# Altium project MB1520.PrjPcb (part 4 of 5)

## Sheet STlink_V3E_Module.SchDoc: STLINK-V3E SWD Module
size A4; Date: Not used; ApprovedBy: Not used; CheckedBy: Not used; Author: Not used; CompanyName: STMicroelectronics; DrawnBy: Not used; Engineer: Not used; Organization: Not used; Address1: Not used; Address2: Not used; Address3: Not used; Address4: Not used; DocumentNumber: Not used; Revision: Not used; SheetNumber: 17; SheetTotal: 19; CurrentTime: Not used; CurrentDate: Not used; Time: Not used; DocumentFullPathAndName: Not used; DocumentName: Not used; ModifiedDate: Not used; ImagePath: Not used; ProjectName: Not used; Application_BuildNumber: Not used
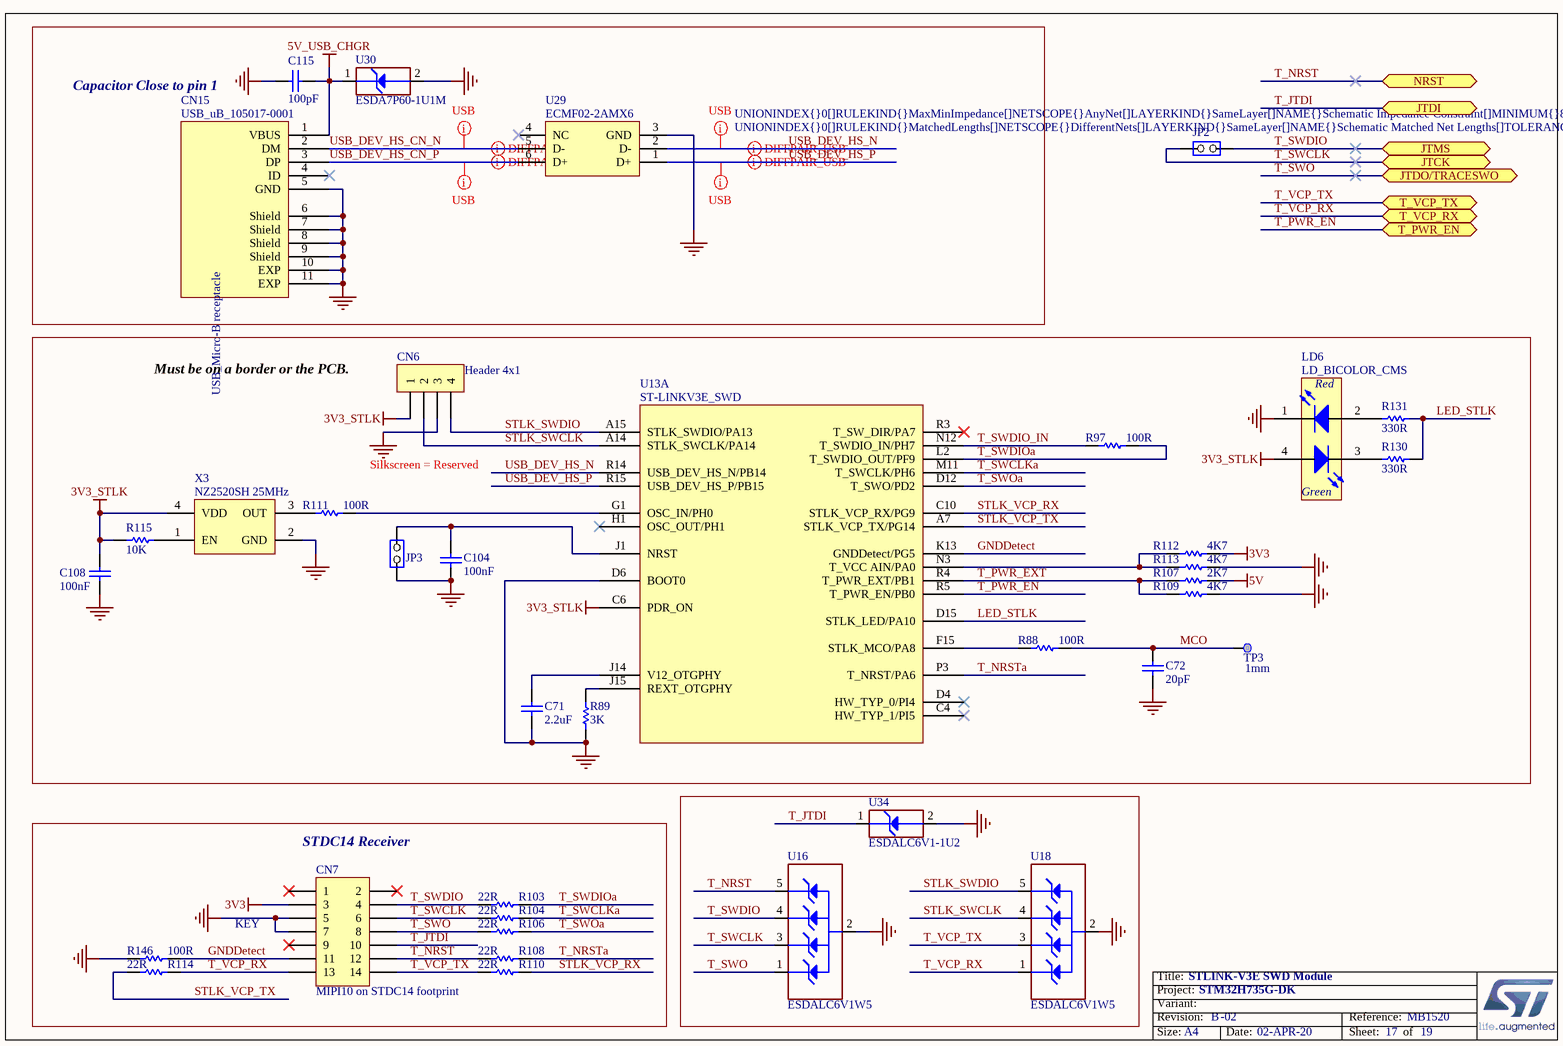
[diagram p12: STlink_V3E_Module.SchDoc]

### Parts
C71  value 2.2uF  [C0603]  (hidden comment: Capacitor)
C72  value 20pF  [C0402]  (hidden comment: Capacitor)
C104  value 100nF  [C0402]  (hidden comment: Capacitor)
C108  value 100nF  [C0402]  (hidden comment: Capacitor)
C115  value 100pF  [C0402]  (hidden comment: Capacitor)
CN6  Header 4x1  [CON_SAMTEC_TSW-104-07-G-S]
CN7  value MIPI10 on STDC14 footprint  [CON_STDC14_Receiver_MEDIUM_WITH_MIPI10_3D]  (hidden comment: Header 7x2)
CN15  value USB_uB_105017-0001  [CON_USBMICROB_MOLEX_105017-0001_H2P90]  (hidden comment: USB_uB_105017.0001)
JP2  Jumper_Header 2x1  [CON_SAMTEC_TSW-102-07-G-S]  (value not drawn)
JP3  Jumper_Header 2x1  [CON_SAMTEC_TSW-102-07-G-S]  (value not drawn)
LD6  LD_BICOLOR_CMS  [LED_BI-GR_HSMF-A201-A00J1]
R88  value 100R  [R0402]  (hidden comment: Resistor)
R89  value 3K  [R0402]  (hidden comment: Resistor)
R97  value 100R  [R0402]  (hidden comment: Resistor)
R103  value 22R  [R0402]  (hidden comment: Resistor)
R104  value 22R  [R0402]  (hidden comment: Resistor)
R106  value 22R  [R0402]  (hidden comment: Resistor)
R107  value 2K7  [R0402]  (hidden comment: Resistor)
R108  value 22R  [R0402]  (hidden comment: Resistor)
R109  value 4K7  [R0402]  (hidden comment: Resistor)
R110  value 22R  [R0402]  (hidden comment: Resistor)
R111  value 100R  [R0402]  (hidden comment: Resistor)
R112  value 4K7  [R0402]  (hidden comment: Resistor)
R113  value 4K7  [R0402]  (hidden comment: Resistor)
R114  value 22R  [R0402]  (hidden comment: Resistor)
R115  value 10K  [R0402]  (hidden comment: Resistor)
R130  value 330R  [R0603]  (hidden comment: Resistor)
R131  value 330R  [R0603]  (hidden comment: Resistor)
R146  value 100R  [R0402]  (hidden comment: Resistor)
TP3  value 1mm  [TP_SMD_1MM]  (hidden comment: Test Point)  (no BOM)
U13  ST-LINKV3E_SWD  [ICC_UFBGA201_176+25_10X10_P065]  (part A of 2)
U16  ESDALC6V1W5  [ESD_SOT323-5L]
U18  ESDALC6V1W5  [ESD_SOT323-5L]
U29  ECMF02-2AMX6  [ESD_QFN-6L_1P7X1P5_P050]
U30  value ESDA7P60-1U1M  [ESD_QFN2_1P6X1_P125]  (hidden comment: ESD-TRANSIL)
U34  value ESDALC6V1-1U2  [ESD_ST0201]  (hidden comment: ESD-TRANSIL)
X3  value NZ2520SH 25MHz  [OSC_NDK_NZ2520SB_4P]  (hidden comment: OSCILLATOR_4_PINS)

### Blocks framed on the sheet
Capacitor Close to pin 1: C115 CN15 U29 U30
Must be on a border or the PCB.: C71 C72 C104 C108 CN6 JP3 LD6 R88 R89 R97 R107 R109 R111-R113 R115 R130 R131 TP3 U13 X3
STDC14 Receiver: CN7 R103 R104 R106 R108 R110 R114 R146

### Ports
JTCK, JTDI, JTDO/TRACESWO, JTMS, NRST, T_PWR_EN, T_VCP_RX, T_VCP_TX

### Nets
3V3: CN7.3 R112.2
3V3_STLK: C108.2 CN6.1 LD6.4(YellowGreen_anode) R115.1 U13.C6(PDR_ON) X3.4(VDD)
5V: R107.1
5V_USB_CHGR: C115.2 CN15.1(VBUS) U30.1(IO1)
GND: C71.1 C72.1 C104.1 C108.1 C115.1 CN6.3 CN7.5 CN7.7 CN15.5(GND) CN15.6(Shield) CN15.7(Shield) CN15.8(Shield) CN15.9(Shield) CN15.10(EXP) CN15.11(EXP) JP3.1(COMMON) LD6.1(RED_cathode) R89.1 R109.1 R113.2 R146.1 U13.D6(BOOT0) U16.2(GND) U18.2(GND) U29.3(GND) U30.2(GND) U34.2(GND) X3.2(GND)  [project net POE7]
GNDDetect: CN7.11 R146.2 U13.K13(GNDDetect/PG5)
LED_STLK: R130.2 R131.2 U13.D15(STLK_LED/PA10)
MCO: C72.2 R88.2 TP3.1
STLK_SWCLK: CN6.2 U13.A14(STLK_SWCLK/PA14) U18.4(IO3)
STLK_SWDIO: CN6.4 U13.A15(STLK_SWDIO/PA13) U18.5(IO4)
STLK_VCP_RX: R110.2 U13.C10(STLK_VCP_RX/PG9)
STLK_VCP_TX: R114.1 U13.A7(STLK_VCP_TX/PG14)
T_JTDI: CN7.10 U34.1(IO1) ; port JTDI
T_NRST: CN7.12 R108.1 U16.5(IO4) ; port NRST  [project net RESET]
T_NRSTa: R108.2 U13.P3(T_NRST/PA6)
T_PWR_EN: U13.R5(T_PWR_EN/PB0) ; port T_PWR_EN
T_PWR_EXT: R107.2 R109.2 U13.R4(T_PWR_EXT/PB1)
T_SWCLK: CN7.6 JP2.1(COMMON) R104.1 U16.3(IO2) ; port JTCK
T_SWCLKa: R104.2 U13.M11(T_SWCLK/PH6)
T_SWDIO: CN7.4 JP2.2(NO) R103.1 U16.4(IO3) ; port JTMS
T_SWDIO_IN: R97.1 U13.N12(T_SWDIO_IN/PH7)
T_SWDIOa: R97.2 R103.2 U13.L2(T_SWDIO_OUT/PF9)
T_SWO: CN7.8 R106.1 U16.1(IO1) ; port JTDO/TRACESWO
T_SWOa: R106.2 U13.D12(T_SWO/PD2)
T_VCP_RX: CN7.13 R114.2 U18.1(IO1) ; port T_VCP_RX
T_VCP_TX: CN7.14 R110.1 U18.3(IO2) ; port T_VCP_TX
USB_DEV_HS_CN_N: CN15.2(DM) U29.5(D-)
USB_DEV_HS_CN_P: CN15.3(DP) U29.6(D+)
USB_DEV_HS_N: U13.R14(USB_DEV_HS_N/PB14) U29.2(D-)
USB_DEV_HS_P: U13.R15(USB_DEV_HS_P/PB15) U29.1(D+)
NetC71_2: C71.2 U13.J14(V12_OTGPHY)
NetC104_2: C104.2 JP3.2(NO) U13.J1(NRST)
NetLD6_2: LD6.2(Red_anode) R131.1
NetLD6_3: LD6.3(YellowGreen_cathode) R130.1
NetR88_1: R88.1 U13.F15(STLK_MCO/PA8)
NetR89_2: R89.2 U13.J15(REXT_OTGPHY)
NetR111_1: R111.1 X3.3(OUT)
NetR111_2: R111.2 U13.G1(OSC_IN/PH0)
NetR112_1: R112.1 R113.1 U13.N3(T_VCC_AIN/PA0)
NetR115_2: R115.2 X3.1(EN)

Not connected (* = marked no-connect by the designer): CN7 1* 2* 9*; CN15 4(ID)*; U13 C4(HW_TYP_1/PI5)* D4(HW_TYP_0/PI4)* H1(OSC_OUT/PH1)* R3(T_SW_DIR/PA7)*; U29 4(NC)*

### Layout directives
differential pair; rule Impedance Constraint [Min = 85.00    Max = 95.00    ]: USB_DEV_HS_CN_N, USB_DEV_HS_CN_P, USB_DEV_HS_N, USB_DEV_HS_P
rule Undefined; rule Matched Net Lengths [Tolerance = 0.2mm]; rule Impedance Constraint [Min = 85.00    Max = 95.00    ]: USB_DEV_HS_CN_N, USB_DEV_HS_CN_P, USB_DEV_HS_N, USB_DEV_HS_P

### Notes on the sheet
- Silkscreen = Reserved
- KEY
- Title:
- Project:
- Size:
- Revision:
- Variant:
- A4
- -
- Date:
- Reference:
- Sheet:
- of
- (in symbol MCD-00028) USB_Micro-B receptacle
- (in symbol MCD-00051) Red; Green

### Library data of the parts
C71 = MCD-00012: Capacitor, MLCC, 2.2uF, 10V, X5R, 10%, 0603, T=0,8mm; Manufacturer_Part_Number: CC0603KRX5R6BB225; Manufacturer: YAGEO; Alternate_Manufacturer_Part_Number: C0603C225K8PACTU; Alternate_Manufacturer: KEMET; Provided_By: SUBCO; Internal_Part_Number: MCD-00012; Status: Released; Package: C0603; ComponentLink1Description: Datasheet; Part_Type: Capacitor; ComponentLink1URL: http://tunmcdsvn.tun.st.com/Component_Datasheet_Library/Trunk/Capacitors/Yageo_Multilayer_capacitor_X5R_series_100pF_to_100uF
C72 = MCD-00016: Capacitor, MLCC, 20pF, 50V, NPO, 5%, 0402, T=0,5mm; Manufacturer_Part_Number: CC0402JRNPO9BN200; Manufacturer: YAGEO; Provided_By: SUBCO; Internal_Part_Number: MCD-00016; Status: Released; Package: C0402; ComponentLink1Description: Datasheet; Part_Type: Capacitor; ComponentLink1URL: http://tunmcdsvn.tun.st.com/Component_Datasheet_Library/Trunk/Capacitors/Yageo_Capacitor_NP0_16V-to-50V
C104 C108 = MCD-00102: Capacitor, MLCC, 100nF, 16V, X7R, 10%, 0402, T=0,5mm; Manufacturer_Part_Number: CC0402KRX7R7BB104; Manufacturer: YAGEO; Alternate_Manufacturer_Part_Number: GCM155R71C104KA55D; Alternate_Manufacturer: MURATA; Provided_By: SUBCO; Internal_Part_Number: MCD-00102; Status: Released; Package: C0402; ComponentLink1Description: Datasheet; Part_Type: Capacitor; ComponentLink1URL: http://tunmcdsvn.tun.st.com/Component_Datasheet_Library/Trunk/Capacitors/Yageo_Multilayer_Capacitor_X7R_series_100pF_to_22uF
C115 = MCD-00205: Capacitor, MLCC, 100pF, 50V, NPO, 5%, 0402, T=0,5mm; Manufacturer_Part_Number: CC0402JRNPO9BN101; Manufacturer: YAGEO; Provided_By: SUBCO; Internal_Part_Number: MCD-00205; Status: Released; Part_Type: Capacitor; Package: C0402; ComponentLink1Description: Datasheet; ComponentLink1URL: http://tunmcdsvn.tun.st.com/Component_Datasheet_Library/Trunk/Capacitors/Yageo_Capacitor_NP0_16V-to-50V
CN6 = MCD-00029: Header, 4x1, 2,54mm, VR, TH, Height 5.84mm/2.54mm; Manufacturer_Part_Number: TSW-104-07-x-S; Manufacturer: SAMTEC; Part_Type: Connector; Provided_By: SUBCO; Internal_Part_Number: MCD-00029; Value: Header 4x1; Status: Released; ComponentLink1Description: Datasheet; ComponentLink1URL: http://tunmcdsvn.tun.st.com/Component_Datasheet_Library/Trunk/Connectors/Samtec_TSW-HTSW-series
CN7 = MCD-01226: Header 5x2, 1.27mm, Dual row, Straight, Surface mount, vertical male connector. 3.05mm lead. Mates with FFSD connector. Footprint compatible with FTSH-107-01-L-DV,-K,-A,-P,-ES (STDC14 MEDIUM); Manufacturer_Part_Number: FTSH-105-01-L-DV-K; Manufacturer: SAMTEC; Alternate_Manufacturer_Part_Number: P127B-2x05MGF-079-1A; Alternate_Manufacturer: JIUBABA; Provided_By: SUBCO; Internal_Part_Number: MCD-01226; Status: Released; Part_Type: Connector; ComponentLink1Description: Datasheet; ComponentLink1URL: http://tunmcdsvn.tun.st.com/Component_Datasheet_Library/Trunk/Connectors/Samtec_FTSH_smt_series; ECCN_US: n/a; ECCN_EU: n/a
CN15 = MCD-00028: USB-MICRO-B, 0.65mm, RA, SMT, Bottom Mount,; Manufacturer_Part_Number: 1050170001; Manufacturer: MOLEX; Part_Type: Connector; Provided_By: SUBCO; Internal_Part_Number: MCD-00028; Status: Released; ComponentLink1Description: Datasheet; ComponentLink1URL: http://tunmcdsvn.tun.st.com/Component_Datasheet_Library/Trunk/Connectors/Molex_Connector-USB-microB_105017-0001
JP2 JP3 = MCD-00045: Header, 2x1, 2,54mm, VR, TH, Height 5.84mm/2.54mm; Manufacturer_Part_Number: TSW-102-07-x-S; Manufacturer: SAMTEC; Part_Type: Connector; Alternate_Manufacturer_Part_Number: 313102S111116; Alternate_Manufacturer: JIUBABA; Value: Shunt not fitted; Provided_By: SUBCO; Internal_Part_Number: MCD-00045; Status: Released; ComponentLink1Description: Datasheet; ComponentLink1URL: http://tunmcdsvn.tun.st.com/Component_Datasheet_Library/Trunk/Connectors/Samtec_TSW-HTSW-series
LD6 = MCD-00051: LED Bicolor; Part_Type: Display; Manufacturer_Part_Number: HSMF-A201-A00J1; Manufacturer: AVAGO TECHNOLOGIES; Alternate_Manufacturer_Part_Number: LE-RGW35280; Alternate_Manufacturer: EVERLUCK; Provided_By: SUBCO; Internal_Part_Number: MCD-00051; Value: LD_BICOLOR_CMS; Status: Released; ComponentLink1Description: Datasheet; ComponentLink1URL: http://tunmcdsvn.tun.st.com/Component_Datasheet_Library/Trunk/Display/Avago_LED-SMC_HSMx-A2xx-02Feb2012
R88 R97 R111 R146 = MCD-00119: Resistor,100R,0402,1%,1/16W; Manufacturer_Part_Number: RC0402FR-07100RL; Manufacturer: YAGEO; Provided_By: SUBCO; Internal_Part_Number: MCD-00119; Status: Released; Part_Type: Resistor; ComponentLink1Description: Datasheet; Package: R0402; ComponentLink1URL: http://tunmcdsvn.tun.st.com/Component_Datasheet_Library/Trunk/Resistors/Yageo_Resistor_RC0402-series
R89 = MCD-00185: Resistor,3K,0402,1%,1/16W; Manufacturer_Part_Number: RC0402FR-073KL; Manufacturer: YAGEO; Provided_By: SUBCO; Internal_Part_Number: MCD-00185; Status: Released; ComponentLink1Description: Datasheet; Part_Type: Resistor; Package: R0402; ComponentLink1URL: http://tunmcdsvn.tun.st.com/Component_Datasheet_Library/Trunk/Resistors/Yageo_Resistor_RC0402-series
R103 R104 R106 R108 R110 R114 = MCD-00189: Resistor,22R,0402,1%,1/16W; Manufacturer_Part_Number: RC0402FR-0722RL; Manufacturer: YAGEO; Provided_By: SUBCO; Internal_Part_Number: MCD-00189; Status: Released; Part_Type: Resistor; ComponentLink1Description: Datasheet; Package: R0402; ComponentLink1URL: http://tunmcdsvn.tun.st.com/Component_Datasheet_Library/Trunk/Resistors/Yageo_Resistor_RC0402-series
R107 = MCD-00055: Resistor,2K7,0402,1%,1/16W; Manufacturer_Part_Number: RC0402FR-072K7L; Manufacturer: YAGEO; Provided_By: SUBCO; Internal_Part_Number: MCD-00055; Status: Released; ComponentLink1Description: Datasheet; Part_Type: Resistor; Package: R0402; ComponentLink1URL: http://tunmcdsvn.tun.st.com/Component_Datasheet_Library/Trunk/Resistors/Yageo_Resistor_RC0402-series
R109 R112 R113 = MCD-00065: Resistor,4K7,0402,1%,1/16W; Manufacturer_Part_Number: RC0402FR-074K7L; Manufacturer: YAGEO; Alternate_Manufacturer_Part_Number: RT0402FRE074K7L; Provided_By: SUBCO; Internal_Part_Number: MCD-00065; Status: Released; ComponentLink1Description: Datasheet; Alternate_Manufacturer: YAGEO; Part_Type: Resistor; Package: R0402; ComponentLink1URL: http://tunmcdsvn.tun.st.com/Component_Datasheet_Library/Trunk/Resistors/Yageo_Resistor_RC0402-series
R115 = MCD-00053: Resistor,10K,0402,1%,1/16W; Manufacturer_Part_Number: RC0402FR-0710KL; Manufacturer: YAGEO; Provided_By: SUBCO; Internal_Part_Number: MCD-00053; Status: Released; ComponentLink1Description: Datasheet; Part_Type: Resistor; Package: R0402; ComponentLink1URL: http://tunmcdsvn.tun.st.com/Component_Datasheet_Library/Trunk/Resistors/Yageo_Resistor_RC0402-series
R130 R131 = MCD-00197: Resistor,330R,0603,1%,1/10W; Manufacturer_Part_Number: RC0603FR-07330RL; Manufacturer: YAGEO; BMS_Part_Number: 9129729; Provided_By: SUBCO; Internal_Part_Number: MCD-00197; Status: Released; ComponentLink1Description: Datasheet; Part_Type: Resistor; Package: R0603; ComponentLink1URL: http://tunmcdsvn.tun.st.com/Component_Datasheet_Library/Trunk/Resistors/Yageo_Resistor_RC0603-series
TP3 = MCD-00074: Test Point 1mm; Part_Type: Mechanical; Initial_Board_Reference: MB1274; Internal_Part_Number: MCD-00074; Status: Released; ECCN_US: n/a; ECCN_EU: n/a; Provided_By: n/a; Manufacturer_Part_Number: n/a; Manufacturer: n/a; ComponentLink1Description: Datasheet; ComponentLink1URL: http://na
U13 = MCD-00596: STM32F723IEK  (STM32F7) BGA176; Part_Type: IC; Manufacturer_Part_Number: STM32F723IEK6; Manufacturer: STMICROELECTRONICS; BMS_Part_Number: 9175300; Provided_By: SUBCO with ST control; Internal_Part_Number: MCD-00596; Value: ST-LINKV3E_SWD; Status: Released; ComponentLink1Description: Datasheet; ComponentLink1URL: http://tunmcdsvn.tun.st.com/Component_Datasheet_Library/Trunk/IC/BGA176+25L_10x10x0.6_pitch0.65
U16 U18 = MCD-00136: Dual Transil array for ESD protection; Part_Type: Diode; Manufacturer: STMICROELECTRONICS; BMS_Part_Number: 9151112; Provided_By: SUBCO with ST control; Internal_Part_Number: MCD-00136; Value: ESDALC6V1W5; Status: Released; Manufacturer_Part_Number: ESDALC6V1W5; ComponentLink1Description: Datasheet; ComponentLink1URL: http://tunmcdsvn.tun.st.com/Component_Datasheet_Library/Trunk/Diodes/STM_ESD_ESDALC6V1W5
U29 = MCD-00649: Common mode filter with ESD protection for USB 2.0 interface; Part_Type: Diode; Manufacturer: STMICROELECTRONICS; BMS_Part_Number: 9151138; Provided_By: SUBCO with ST control; Internal_Part_Number: MCD-00649; Value: ECMF02-2AMX6; Status: Released; Manufacturer_Part_Number: ECMF02-2AMX6; ComponentLink1Description: Datasheet; ComponentLink1URL: http://tunmcdsvn.tun.st.com/Component_Datasheet_Library/Trunk/Diodes/STM_ESD_ECMF02-2AMX6
U30 = MCD-00251: High power transient voltage suppressor, 7V breakdown; Part_Type: Diode; Manufacturer: STMICROELECTRONICS; BMS_Part_Number: 9179042; Provided_By: SUBCO with ST control; Internal_Part_Number: MCD-00251; Status: Released; Manufacturer_Part_Number: ESDA7P60-1U1M; ComponentLink1Description: Datasheet; ComponentLink1URL: http://tunmcdsvn.tun.st.com/Component_Datasheet_Library/Trunk/Diodes/STM_ESD_ESDA7P60-1U1M
U34 = MCD-00170: ESD protection 6V1; Part_Type: Diode; Manufacturer: STMICROELECTRONICS; BMS_Part_Number: 9151132; ECCN_US: EAR99; ECCN_EU: NEC; Provided_By: SUBCO with ST control; Internal_Part_Number: MCD-00170; Status: Released; Manufacturer_Part_Number: ESDALC6V1-1U2; ComponentLink1Description: Datasheet; ComponentLink1URL: http://tunmcdsvn.tun.st.com/Component_Datasheet_Library/Trunk/Diodes/STM_ESD_ESDALC6V1-1U2
X3 = MCD-00597: Oscillator 25Mhz, +-50ppm, Vcc:3.3V typ, square wave: [0.1Vcc;0.9Vcc], Enable pin, SMD; Part_Type: Crystal_Osc; Manufacturer_Part_Number: NZ2520SH 25MHz END4869C; Manufacturer: NDK; Alternate_Manufacturer_Part_Number: NZ2520SB 25MHz END4869B; BMS_Part_Number: 9157050; Provided_By: SUBCO; Internal_Part_Number: MCD-00597; Status: Released; Alternate_Manufacturer: NDK; ComponentLink1Description: Datasheet; ComponentLink1URL: http://tunmcdsvn.tun.st.com/Component_Datasheet_Library/Trunk/Crystal_Osc/NDK_NZ2520SH 25MHz END4869C

## Sheet STlink_V3E_PWR.SchDoc: STLINK-V3E SWD Power Module
size A4; Date: Not used; ApprovedBy: Not used; CheckedBy: Not used; Author: Not used; CompanyName: STMicroelectronics; DrawnBy: Not used; Engineer: Not used; Organization: Not used; Address1: Not used; Address2: Not used; Address3: Not used; Address4: Not used; DocumentNumber: Not used; Revision: Not used; SheetNumber: 18; SheetTotal: 19; CurrentTime: Not used; CurrentDate: Not used; Time: Not used; DocumentFullPathAndName: Not used; DocumentName: Not used; ModifiedDate: Not used; ImagePath: Not used; ProjectName: Not used; Application_BuildNumber: Not used
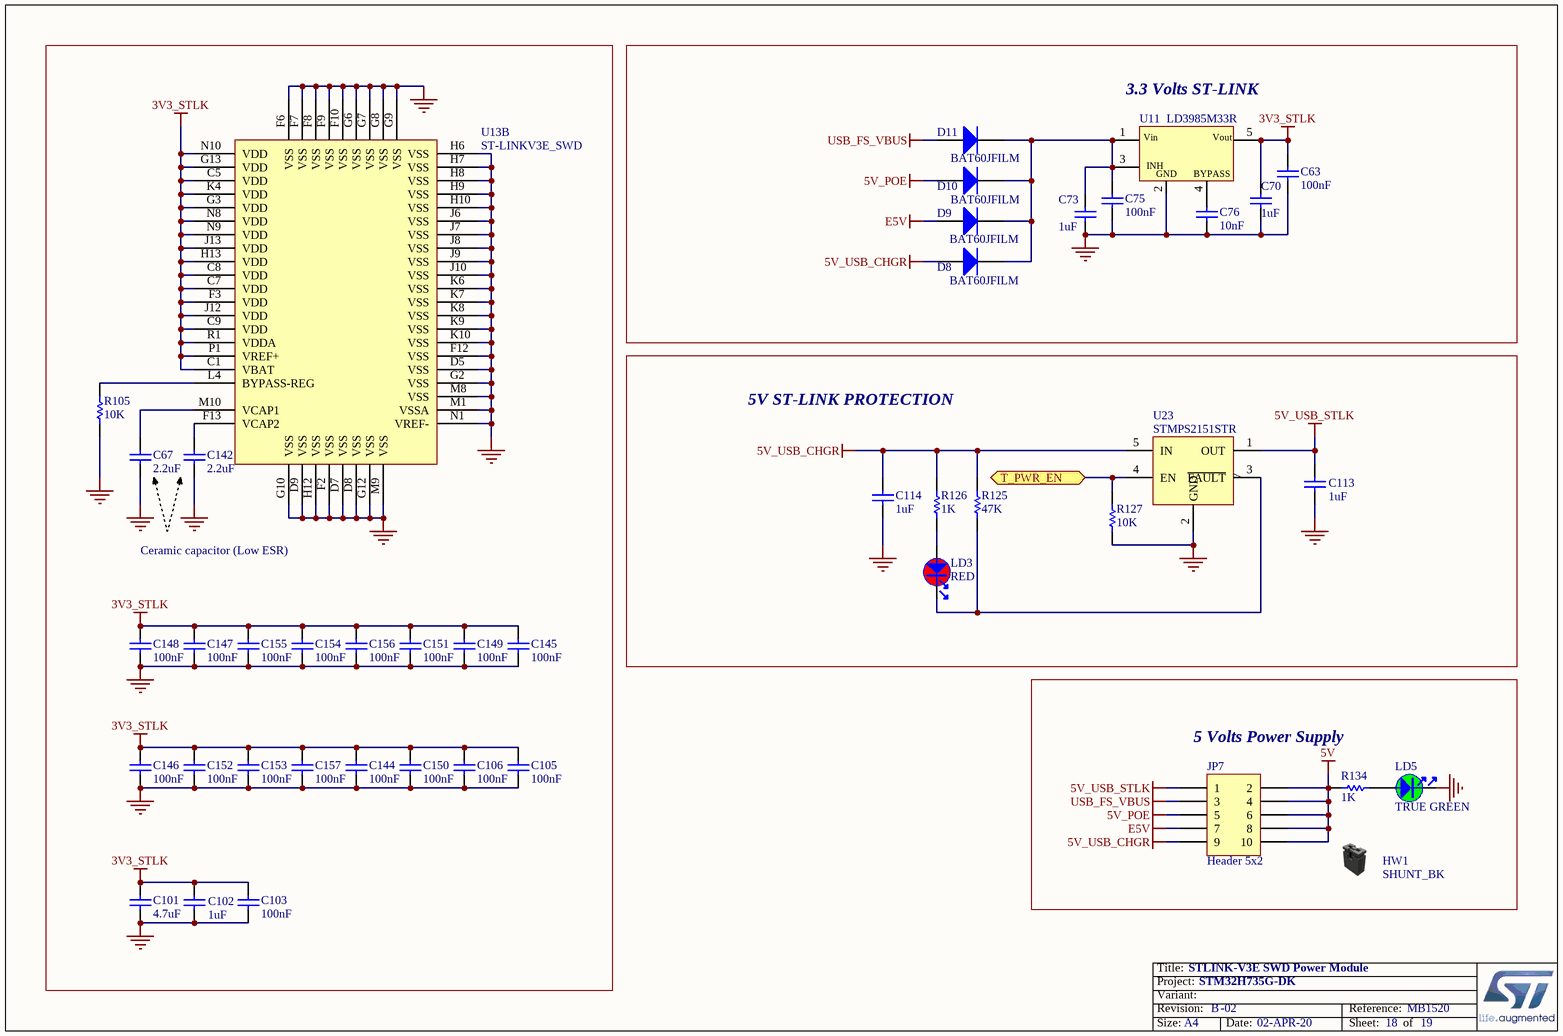
[diagram p13: STlink_V3E_PWR.SchDoc]

### Parts
C63  value 100nF  [C0402]  (hidden comment: Capacitor)
C67  value 2.2uF  [C1206_H1P15]  (hidden comment: Capacitor)
C70  value 1uF  [C0603]  (hidden comment: Capacitor)
C73  value 1uF  [C0603]  (hidden comment: Capacitor)
C75  value 100nF  [C0402]  (hidden comment: Capacitor)
C76  value 10nF  [C0402]  (hidden comment: Capacitor)
C101  value 4.7uF  [C0603]  (hidden comment: Capacitor)
C102  value 1uF  [C0603]  (hidden comment: Capacitor)
C103  value 100nF  [C0402]  (hidden comment: Capacitor)
C105  value 100nF  [C0402]  (hidden comment: Capacitor)
C106  value 100nF  [C0402]  (hidden comment: Capacitor)
C113  value 1uF  [C0603]  (hidden comment: Capacitor)
C114  value 1uF  [C0603]  (hidden comment: Capacitor)
C142  value 2.2uF  [C1206_H1P15]  (hidden comment: Capacitor)
C144  value 100nF  [C0402]  (hidden comment: Capacitor)
C145  value 100nF  [C0402]  (hidden comment: Capacitor)
C146  value 100nF  [C0402]  (hidden comment: Capacitor)
C147  value 100nF  [C0402]  (hidden comment: Capacitor)
C148  value 100nF  [C0402]  (hidden comment: Capacitor)
C149  value 100nF  [C0402]  (hidden comment: Capacitor)
C150  value 100nF  [C0402]  (hidden comment: Capacitor)
C151  value 100nF  [C0402]  (hidden comment: Capacitor)
C152  value 100nF  [C0402]  (hidden comment: Capacitor)
C153  value 100nF  [C0402]  (hidden comment: Capacitor)
C154  value 100nF  [C0402]  (hidden comment: Capacitor)
C155  value 100nF  [C0402]  (hidden comment: Capacitor)
C156  value 100nF  [C0402]  (hidden comment: Capacitor)
C157  value 100nF  [C0402]  (hidden comment: Capacitor)
D8  BAT60JFILM  [DIO_SOD323]
D9  BAT60JFILM  [DIO_SOD323]
D10  BAT60JFILM  [DIO_SOD323]
D11  BAT60JFILM  [DIO_SOD323]
HW1  value SHUNT_BK  [NA]  (hidden comment: Shunt Black 2.54mm)  (mechanical)
JP7  Header 5x2  [CON_988-JIUBABA_PHFS25-12-10-G0B115-T-1]
LD3  value RED  [LED_0603_VISHAY_VLMS1300-GS08_RED_1A2K_H0P8]  (hidden comment: LED_red)
LD5  value TRUE GREEN  [LED_0603_VISHAY_VLMTG1300-GS08_GREEN_1A2K_H0P8]  (hidden comment: LED_green)
R105  value 10K  [R0402]  (hidden comment: Resistor)
R125  value 47K  [R0402]  (hidden comment: Resistor)
R126  value 1K  [R0402]  (hidden comment: Resistor)
R127  value 10K  [R0402]  (hidden comment: Resistor)
R134  value 1K  [R0603]  (hidden comment: Resistor)
U11  LD3985M33R  [REG_SOT23-5L]
U13  ST-LINKV3E_SWD  [ICC_UFBGA201_176+25_10X10_P065]  (part B of 2)
U23  STMPS2151STR  [MOS_SOT23-5L]

### Blocks framed on the sheet
Ceramic capacitor (Low ESR): C67 C101-C103 C105 C106 C142 C144-C157 R105 U13
3.3 Volts ST-LINK: C63 C70 C73 C75 C76 D8-D11 U11
5V ST-LINK PROTECTION: C113 C114 LD3 R125-R127 U23
5 Volts Power Supply: HW1 JP7 LD5 R134

### Ports
T_PWR_EN

### Nets
3V3_STLK: C63.2 C70.2 C101.2 C102.2 C103.2 C105.2 C106.2 C144.2 C145.2 C146.2 C147.2 C148.2 C149.2 C150.2 C151.2 C152.2 C153.2 C154.2 C155.2 C156.2 C157.2 U11.5(Vout) U13.C1(VBAT) U13.C5(VDD) U13.C7(VDD) U13.C8(VDD) U13.C9(VDD) U13.F3(VDD) U13.G3(VDD) U13.G13(VDD) U13.H13(VDD) U13.J12(VDD) U13.J13(VDD) U13.K4(VDD) U13.N8(VDD) U13.N9(VDD) U13.N10(VDD) U13.P1(VREF+) U13.R1(VDDA)
5V: JP7.2 JP7.4 JP7.6 JP7.8 JP7.10 R134.1
5V_POE: D10.1(A) JP7.5
5V_USB_CHGR: C114.2 D8.1(A) JP7.9 R125.2 R126.2 U23.5(IN)
5V_USB_STLK: C113.2 JP7.1 U23.1(OUT)
E5V: D9.1(A) JP7.7
GND: C63.1 C67.1 C70.1 C73.2 C75.1 C76.1 C101.1 C102.1 C103.1 C105.1 C106.1 C113.1 C114.1 C142.1 C144.1 C145.1 C146.1 C147.1 C148.1 C149.1 C150.1 C151.1 C152.1 C153.1 C154.1 C155.1 C156.1 C157.1 LD5.2 R105.1 R127.2 U11.2(GND) U13.D5(VSS) U13.D7(VSS) U13.D8(VSS) U13.D9(VSS) U13.F2(VSS) U13.F6(VSS) U13.F7(VSS) U13.F8(VSS) U13.F9(VSS) U13.F10(VSS) U13.F12(VSS) U13.G2(VSS) U13.G6(VSS) U13.G7(VSS) U13.G8(VSS) U13.G9(VSS) U13.G10(VSS) U13.G12(VSS) U13.H6(VSS) U13.H7(VSS) U13.H8(VSS) U13.H9(VSS) U13.H10(VSS) U13.H12(VSS) U13.J6(VSS) U13.J7(VSS) U13.J8(VSS) U13.J9(VSS) U13.J10(VSS) U13.K6(VSS) U13.K7(VSS) U13.K8(VSS) U13.K9(VSS) U13.K10(VSS) U13.M1(VSSA) U13.M8(VSS) U13.M9(VSS) U13.N1(VREF-) U23.2(GND)  [project net POE7]
USB_FS_VBUS: D11.1(A) JP7.3
T_PWR_EN: R127.1 U23.4(EN) ; port T_PWR_EN
NetC67_2: C67.2 U13.M10(VCAP1)
NetC73_1: C73.1 C75.2 D8.2(K) D9.2(K) D10.2(K) D11.2(K) U11.1(Vin) U11.3(CE)
NetC76_2: C76.2 U11.4(BYPASS)
NetC142_2: C142.2 U13.F13(VCAP2)
NetLD3_1: LD3.1 R126.1
NetLD3_2: LD3.2 R125.1 U23.3(~{FAULT})
NetLD5_1: LD5.1 R134.2
NetR105_2: R105.2 U13.L4(BYPASS-REG)

### Notes on the sheet
- Title:
- Project:
- Size:
- Revision:
- Variant:
- A4
- -
- Date:
- Reference:
- Sheet:
- of
- (in symbol MCD-00086) INH

### Library data of the parts
C63 C75 C103 C105 C106 C144-C157 = MCD-00102: as C104 on sheet STlink_V3E_Module; Internal_Part_Number: MCD-00102; Status: Released; Package: C0402; ComponentLink1Description: Datasheet; Part_Type: Capacitor; ComponentLink1URL: http://tunmcdsvn.tun.st.com/Component_Datasheet_Library/Trunk/Capacitors/Yageo_Multilayer_Capacitor_X7R_series_100pF_to_22uF
C67 C142 = MCD-00008: Capacitor, MLCC, 2.2uF, 16V, X7R, 10%, 1206, T=1,15mm; Manufacturer_Part_Number: CC1206KKX7R7BB225; Manufacturer: YAGEO; Alternate_Manufacturer_Part_Number: C1206C225K4RAC; Alternate_Manufacturer: KEMET; Provided_By: SUBCO; Internal_Part_Number: MCD-00008; Status: Released; Part_Type: Capacitor; Package: C1206; ComponentLink1Description: Datasheet; ComponentLink1URL: http://tunmcdsvn.tun.st.com/Component_Datasheet_Library/Trunk/Capacitors/Yageo_Multilayer_Capacitor_X7R_series_100pF_to_22uF
C70 C102 C113 C114 = MCD-00010: Capacitor, MLCC, 1uF, 16V, X5R, 10%, 0603, T=0,8mm; Manufacturer_Part_Number: CC0603KRX5R7BB105; Manufacturer: YAGEO; Provided_By: SUBCO; Internal_Part_Number: MCD-00010; Status: Released; Package: C0603; ComponentLink1Description: Datasheet; Part_Type: Capacitor; ComponentLink1URL: http://tunmcdsvn.tun.st.com/Component_Datasheet_Library/Trunk/Capacitors/Yageo_Multilayer_capacitor_X5R_series_100pF_to_100uF
C73 = MCD-00238: Capacitor, MLCC, 1uF, 6V3, X5R, 10%, 0603, T=0,8mm; Manufacturer_Part_Number: CC0603KRX5R5BB105; Manufacturer: YAGEO; Provided_By: SUBCO; Internal_Part_Number: MCD-00238; Status: Released; Part_Type: Capacitor; Package: C0603; ComponentLink1Description: Datasheet; ComponentLink1URL: http://tunmcdsvn.tun.st.com/Component_Datasheet_Library/Trunk/Capacitors/Yageo_Multilayer_capacitor_X5R_series_100pF_to_100uF
C76 = MCD-00011: Capacitor, MLCC, 10nF, 16V, X7R, 10%, 0402, T=0.5mm; Manufacturer_Part_Number: CC0402KRX7R7BB103; Manufacturer: YAGEO; Provided_By: SUBCO; Internal_Part_Number: MCD-00011; Status: Released; Part_Type: Capacitor; Package: C0402; ComponentLink1Description: Datasheet; ComponentLink1URL: http://tunmcdsvn.tun.st.com/Component_Datasheet_Library/Trunk/Capacitors/Yageo_Multilayer_Capacitor_X7R_series_100pF_to_22uF
C101 = MCD-00009: Capacitor, MLCC, 4.7uF, 16V, X5R, 10%, 0603, T=0.8mm; Manufacturer_Part_Number: CC0603KRX5R7BB475; Manufacturer: YAGEO; Provided_By: SUBCO; Internal_Part_Number: MCD-00009; Status: Released; Part_Type: Capacitor; Package: C0603; ComponentLink1Description: Datasheet; ComponentLink1URL: http://tunmcdsvn.tun.st.com/Component_Datasheet_Library/Trunk/Capacitors/Yageo_Multilayer_capacitor_X5R_series_100pF_to_100uF
D8-D11 = MCD-00034: Manufacturer: STMICROELECTRONICS; Part_Type: Diode; BMS_Part_Number: 9151097; Provided_By: SUBCO with ST control; Internal_Part_Number: MCD-00034; Value: BAT60JFILM; Status: Released; Manufacturer_Part_Number: BAT60JFILM; ComponentLink1Description: Datasheet; ComponentLink1URL: http://tunmcdsvn.tun.st.com/Component_Datasheet_Library/Trunk/Diodes/STM_Diode_BAT60JFILM-SOD323
HW1 = MCD-00122: SHUNT, 2.54mm, height 6.10mm, BLACK; Manufacturer_Part_Number: SNT-100-BK-G; Manufacturer: SAMTEC; Part_Type: Connector; Provided_By: SUBCO; Internal_Part_Number: MCD-00122; Status: Released; ComponentLink1Description: Datasheet; ComponentLink1URL: http://tunmcdsvn.tun.st.com/Component_Datasheet_Library/Trunk/Connectors/Samtec_Shunt_Jumper_SNT100
JP7 = MCD-00312: Header, 5x2, 2.54mm, VR, TH, Height 6mm/3mm; Part_Type: Connector; Manufacturer_Part_Number: PHFS25-12-10-G0B115-T-1; Manufacturer: JIUBABA; Provided_By: SUBCO; Internal_Part_Number: MCD-00312; Value: Header 5x2; Status: Released; ComponentLink1Description: Datasheet; ComponentLink1URL: http://tunmcdsvn.tun.st.com/Component_Datasheet_Library/Trunk/Connectors/Jiubaba_PHFS25_12XXXXXXXXX1; ECCN_US: n/a; ECCN_EU: n/a
LD3 = MCD-00587: LED Red, 0603 SMD, 2V Forward Voltage; Part_Type: Display; Manufacturer_Part_Number: VLMS1300-GS08; Manufacturer: VISHAY; Alternate_Manufacturer_Part_Number: LS Q976-NR-1; Alternate_Manufacturer: OSRAM OPTO SEMICONDUCTORS; Provided_By: SUBCO; Internal_Part_Number: MCD-00587; Status: Released; Package: LED 0603; ComponentLink1Description: Datasheet; ComponentLink1URL: http://tunmcdsvn.tun.st.com/Component_Datasheet_Library/Trunk/Display/VISHAY_LED_RED_VLMS1300-GS08; Order_Code_Digikey: VLMS1300-GS08CT-ND; Order_Code_Farnell: 2078728
LD5 = MCD-00589: LED Green, 0603 SMD, Fw Voltage = 2.8V - 3.6V; Part_Type: Display; Manufacturer_Part_Number: VLMTG1300-GS08; Manufacturer: VISHAY; Alternate_Manufacturer_Part_Number: LG Q396-PS-35; Alternate_Manufacturer: OSRAM OPTO SEMICONDUCTORS; Order_Code_RS: 7730452; Provided_By: SUBCO; Internal_Part_Number: MCD-00589; Status: Checked; Package: LED 0603; ComponentLink1Description: Datasheet; ComponentLink1URL: http://tunmcdsvn.tun.st.com/Component_Datasheet_Library/Trunk/Display/VISHAY_LED_GREEN_VLMTG1300-GS08; Order_Code_Digikey: VLMTG1300-GS08CT-ND; Order_Code_Farnell: 2251490
R105 R127 = MCD-00053: as R115 on sheet STlink_V3E_Module; Internal_Part_Number: MCD-00053; Status: Released; ComponentLink1Description: Datasheet; Part_Type: Resistor; Package: R0402; ComponentLink1URL: http://tunmcdsvn.tun.st.com/Component_Datasheet_Library/Trunk/Resistors/Yageo_Resistor_RC0402-series
R125 = MCD-00063: Resistor,47K,0402,1%,1/16W; Manufacturer_Part_Number: RC0402FR-0747KL; Manufacturer: YAGEO; Provided_By: SUBCO; Internal_Part_Number: MCD-00063; Status: Released; ComponentLink1Description: Datasheet; Part_Type: Resistor; Package: R0402; ComponentLink1URL: http://tunmcdsvn.tun.st.com/Component_Datasheet_Library/Trunk/Resistors/Yageo_Resistor_RC0402-series
R126 = MCD-00061: Resistor,1K,0402,1%,1/16W; Manufacturer_Part_Number: RC0402FR-071KL; Manufacturer: YAGEO; Provided_By: SUBCO; Internal_Part_Number: MCD-00061; Status: Released; ComponentLink1Description: Datasheet; Part_Type: Resistor; Package: R0402; ComponentLink1URL: http://tunmcdsvn.tun.st.com/Component_Datasheet_Library/Trunk/Resistors/Yageo_Resistor_RC0402-series
R134 = MCD-00070: Resistor,1K,0603,1%,1/10W; Manufacturer_Part_Number: RC0603FR-071KL; Manufacturer: YAGEO; Provided_By: SUBCO; Internal_Part_Number: MCD-00070; Status: Released; ComponentLink1Description: Datasheet; Part_Type: Resistor; Package: R0603; ComponentLink1URL: http://tunmcdsvn.tun.st.com/Component_Datasheet_Library/Trunk/Resistors/Yageo_Resistor_RC0603-series
U11 = MCD-00086: Ultra low drop-low noise BiCMOS voltage, regulators low ESR capacitors compatible; Manufacturer: STMICROELECTRONICS; Part_Type: IC; BMS_Part_Number: 9176161; Provided_By: SUBCO with ST control; Internal_Part_Number: MCD-00086; Value: LD3985M33R; Status: Released; Manufacturer_Part_Number: LD3985M33R; ComponentLink1Description: Datasheet; ComponentLink1URL: http://tunmcdsvn.tun.st.com/Component_Datasheet_Library/Trunk/IC/STM_LDO_LD3985
U13 = MCD-00596: as U13 on sheet STlink_V3E_Module; Internal_Part_Number: MCD-00596; Value: ST-LINKV3E_SWD; Status: Released; ComponentLink1Description: Datasheet; ComponentLink1URL: http://tunmcdsvn.tun.st.com/Component_Datasheet_Library/Trunk/IC/BGA176+25L_10x10x0.6_pitch0.65
U23 = MCD-00159: 500mA, Enhanced single channel power switches with active high enable pin; Part_Type: IC; Manufacturer: STMICROELECTRONICS; Alternate_Manufacturer_Part_Number: TPS2051C; Alternate_Manufacturer: TEXAS INSTRUMENTS; BMS_Part_Number: 9159009; Provided_By: SUBCO with ST control; Internal_Part_Number: MCD-00159; Value: STMPS2151STR; Status: Released; Manufacturer_Part_Number: STMPS2151STR; ComponentLink1Description: Datasheet; ComponentLink1URL: http://tunmcdsvn.tun.st.com/Component_Datasheet_Library/Trunk/IC/STM_PWR-Switch_STMPS2151STR

## Sheet OCSPI.SchDoc: OCSPI
size A4; CompanyName: STMicroelectronics; Organization: Microcontrollers Division; DocumentNumber: 8; SheetNumber: 9; SheetTotal: 19
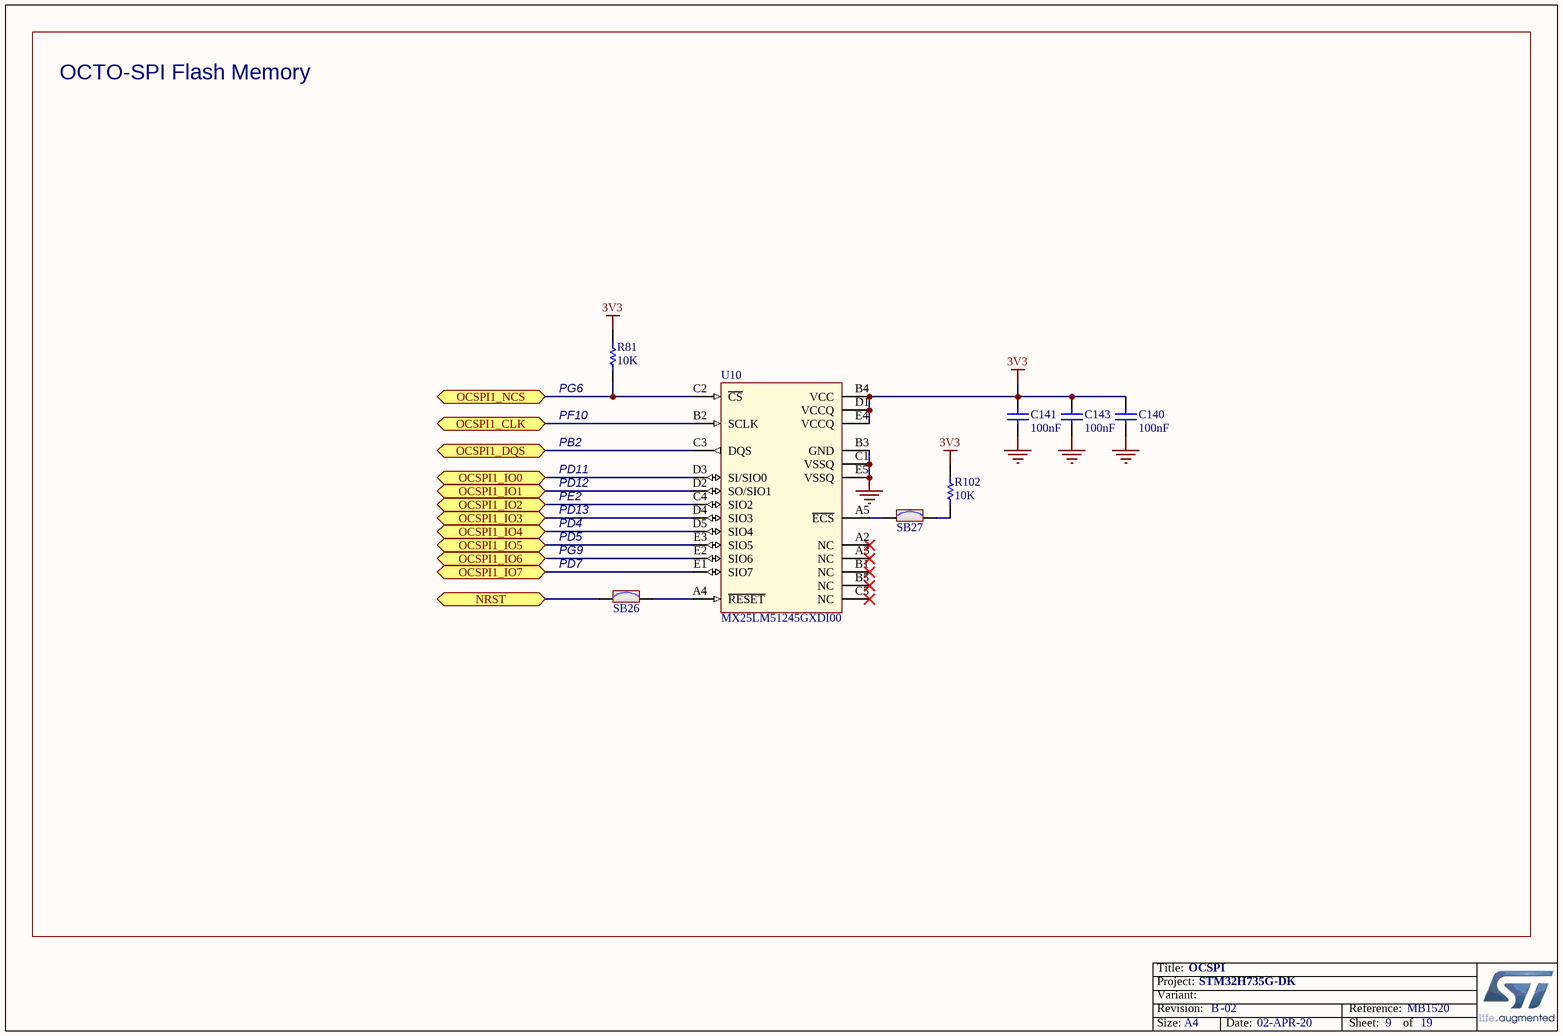
[diagram p14: OCSPI.SchDoc]

### Parts
C140  value 100nF  [C0402]  (hidden comment: Capacitor)
C141  value 100nF  [C0402]  (hidden comment: Capacitor)
C143  value 100nF  [C0402]  (hidden comment: Capacitor)
R81  value 10K  [R0402]  (hidden comment: Resistor)
R102  value 10K  [R0402]  (hidden comment: Resistor)
SB26  SB_ON  [SOLDER-BRIDGE_R0603-0R]  (value not drawn)
SB27  SB_ON  [SOLDER-BRIDGE_R0603-0R]  (value not drawn)
U10  MX25LM51245GXDI00  [ICC_BGA24_5X5-BALL-ARRAY_6X8_P1]

### Ports
NRST, OCSPI1_CLK (bidir), OCSPI1_DQS (bidir), OCSPI1_IO0 (bidir), OCSPI1_IO1 (bidir), OCSPI1_IO2 (bidir), OCSPI1_IO3 (bidir), OCSPI1_IO4 (bidir), OCSPI1_IO5 (bidir), OCSPI1_IO6 (bidir), OCSPI1_IO7 (bidir), OCSPI1_NCS (bidir)

### Nets
3V3: C140.2 C141.2 C143.2 R81.2 R102.2 U10.B4(VCC) U10.D1(VCCQ) U10.E4(VCCQ)
GND: C140.1 C141.1 C143.1 U10.B3(GND) U10.C1(VSSQ) U10.E5(VSSQ)  [project net POE7]
OCSPI1_CLK: U10.B2(SCLK) ; port OCSPI1_CLK
OCSPI1_DQS: U10.C3(DQS) ; port OCSPI1_DQS
OCSPI1_IO0: U10.D3(SI/SIO0) ; port OCSPI1_IO0
OCSPI1_IO1: U10.D2(SO/SIO1) ; port OCSPI1_IO1
OCSPI1_IO2: U10.C4(SIO2) ; port OCSPI1_IO2
OCSPI1_IO3: U10.D4(SIO3) ; port OCSPI1_IO3
OCSPI1_IO4: U10.D5(SIO4) ; port OCSPI1_IO4
OCSPI1_IO5: U10.E3(SIO5) ; port OCSPI1_IO5
OCSPI1_IO6: U10.E2(SIO6) ; port OCSPI1_IO6
OCSPI1_IO7: U10.E1(SIO7) ; port OCSPI1_IO7
OCSPI1_NCS: R81.1 U10.C2(~{CS}) ; port OCSPI1_NCS
RESET: SB26.1 ; port NRST
NetR102_1: R102.1 SB27.2
NetSB26_2: SB26.2 U10.A4(~{RESET})
NetSB27_1: SB27.1 U10.A5(~{ECS})

Not connected (* = marked no-connect by the designer): U10 A2(NC)* A3(NC)* B1(NC)* B5(NC)* C5(NC)*

### Notes on the sheet
- OCTO-SPI Flash Memory
- (near R81) PG6
- (near R81) PF10
- PB2
- PD11
- PD12
- PE2
- PD13
- PD4
- PD5
- PG9
- (near SB26) PD7
- Title:
- Project:
- Size:
- Revision:
- Variant:
- A4
- -
- Date:
- Reference:
- Sheet:
- of

### Library data of the parts
C140 C141 C143 = MCD-00102: Capacitor, MLCC, 100nF, 16V, X7R, 10%, 0402, T=0,5mm; Manufacturer_Part_Number: CC0402KRX7R7BB104; Manufacturer: YAGEO; Alternate_Manufacturer_Part_Number: GCM155R71C104KA55D; Alternate_Manufacturer: MURATA; ECCN_US: EAR99; ECCN_EU: NEC; Provided_By: SUBCO; Internal_Part_Number: MCD-00102; Status: Released; Part_Type: Capacitor; Package: C0402; ComponentLink1Description: Datasheet; ComponentLink1URL: http://tunmcdsvn.tun.st.com/Component_Datasheet_Library/Trunk/Capacitors/Yageo_Multilayer_Capacitor_X7R_series_100pF_to_22uF
R81 R102 = MCD-00053: Resistor,10K,0402,1%,1/16W; Manufacturer_Part_Number: RC0402FR-0710KL; Manufacturer: YAGEO; ECCN_US: EAR99; ECCN_EU: NEC; Provided_By: SUBCO; Internal_Part_Number: MCD-00053; Status: Released; Part_Type: Resistor; Package: R0402; ComponentLink1Description: Datasheet; ComponentLink1URL: http://tunmcdsvn.tun.st.com/Component_Datasheet_Library/Trunk/Resistors/Yageo_Resistor_RC0402-series
SB26 SB27 = MCD-00071: Solder Bridge ON; Part_Type: Mechanical; Manufacturer_Part_Number: RC0603JR-070RL; Manufacturer: YAGEO; Provided_By: SUBCO; Internal_Part_Number: MCD-00071; Status: Released; Package: SB0603; ComponentLink1Description: Datasheet; ComponentLink1URL: http://tunmcdsvn.tun.st.com/Component_Datasheet_Library/Trunk/Resistors/Yageo_Resistor_RC0603-series; ECCN_US: n/a; ECCN_EU: n/a
U10 = MCD-00246: Memory,Octo-SPI-NOR,512Mb,2048x16,133MHz,3V,DTR,BGA24, CMOS MXSMIO; Part_Type: IC; Manufacturer: MACRONIX; ECCN_US: 3A991.b.1.a; ECCN_EU: NEC; Provided_By: SUBCO; Internal_Part_Number: MCD-00246; Value: MX25LM51245GXDI00; Status: Released; Manufacturer_Part_Number: MX25LM51245GXDI00; Package: BGA24; ComponentLink1Description: Datasheet; ComponentLink1URL: http://tunmcdsvn.tun.st.com/Component_Datasheet_Library/Trunk/IC/Macronix_OctoSPI_NOR_512Mb_MX25LM51245GXDI0A/Macronix_OctoSPI_NOR_512Mb_MX25LM51245G-0.02_Nov22.pdf

## Sheet LCD.SchDoc: LCD
size A4; CompanyName: STMicroelectronics; Organization: Microcontrollers Division; DocumentNumber: 16; SheetNumber: 12; SheetTotal: 19
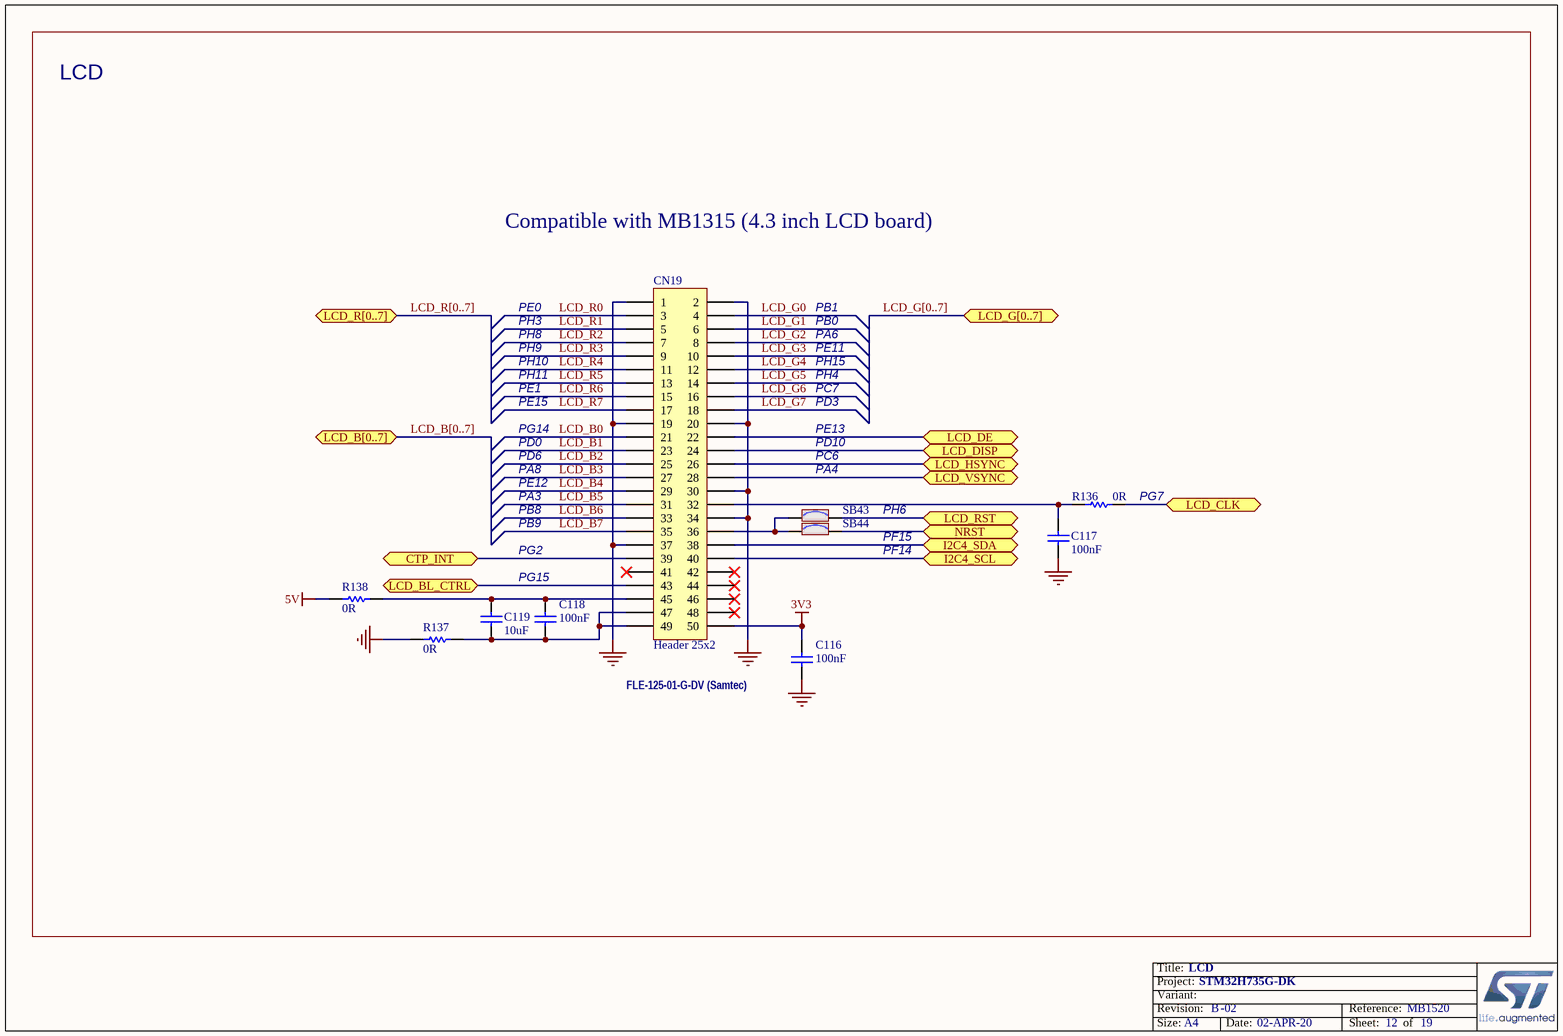
[diagram p15: LCD.SchDoc]

### Parts
C116  value 100nF  [C0402]  (hidden comment: Capacitor)
C117  value 100nF  [C0402]  (hidden comment: Capacitor)
C118  value 100nF  [C0402]  (hidden comment: Capacitor)
C119  value 10uF  [C0805]  (hidden comment: Capacitor)
CN19  Header 25x2  [MOD_LCD_MB1046B__CON_SAMTEC_FLE-125-01-G-DV]
R136  value 0R  [R0402]  (hidden comment: Resistor)
R137  value 0R  [R0603]  (hidden comment: Resistor)
R138  value 0R  [R0603]  (hidden comment: Resistor)
SB43  SB_ON  [SOLDER-BRIDGE_R0603-0R]  (value not drawn)
SB44  SB_ON  [SOLDER-BRIDGE_R0603-0R]  (value not drawn)

### Ports
CTP_INT, I2C4_SCL, I2C4_SDA, LCD_B[0..7], LCD_BL_CTRL, LCD_CLK, LCD_DE, LCD_DISP, LCD_G[0..7], LCD_HSYNC, LCD_R[0..7], LCD_RST, LCD_VSYNC, NRST

### Nets
3V3: C116.1 CN19.50
5V: R138.1
GND: C116.2 C117.1 CN19.1 CN19.2 CN19.19 CN19.20 CN19.30 CN19.34 CN19.37 R137.1  [project net POE7]
CTP_INT: CN19.39 ; port CTP_INT
I2C4_SCL: CN19.40 ; port I2C4_SCL
I2C4_SDA: CN19.38 ; port I2C4_SDA
LCD_B0: CN19.21
LCD_B1: CN19.23
LCD_B2: CN19.25
LCD_B3: CN19.27
LCD_B4: CN19.29
LCD_B5: CN19.31
LCD_B6: CN19.33
LCD_B7: CN19.35
LCD_BL_CTRL: CN19.43 ; port LCD_BL_CTRL
LCD_CLK: R136.2 ; port LCD_CLK
LCD_DE: CN19.22 ; port LCD_DE
LCD_DISP: CN19.24 ; port LCD_DISP
LCD_G0: CN19.4
LCD_G1: CN19.6
LCD_G2: CN19.8
LCD_G3: CN19.10
LCD_G4: CN19.12
LCD_G5: CN19.14
LCD_G6: CN19.16
LCD_G7: CN19.18
LCD_HSYNC: CN19.26 ; port LCD_HSYNC
LCD_R0: CN19.3
LCD_R1: CN19.5
LCD_R2: CN19.7
LCD_R3: CN19.9
LCD_R4: CN19.11
LCD_R5: CN19.13
LCD_R6: CN19.15
LCD_R7: CN19.17
LCD_RST: SB43.2 ; port LCD_RST
LCD_VSYNC: CN19.28 ; port LCD_VSYNC
RESET: SB44.2 ; port NRST
NetC117_2: C117.2 CN19.32 R136.1
NetC118_1: C118.1 C119.2 CN19.45 R138.2
NetC118_2: C118.2 C119.1 CN19.47 CN19.49 R137.2
NetCN19_36: CN19.36 SB43.1 SB44.1

Not connected (* = marked no-connect by the designer): CN19 41* 42* 44* 46* 48*

### Buses and harness runs
bus LCD_B[0..7] = port LCD_B[0..7]
bus LCD_G[0..7] = port LCD_G[0..7]
bus LCD_R[0..7] = port LCD_R[0..7]

### Notes on the sheet
- LCD
- Compatible with MB1315 (4.3 inch LCD board)
- PE0
- PB1
- PH3
- PH8
- PH9
- PH10
- PH11
- PA6
- PB0
- PE11
- PH15
- PH4
- PE1
- PD0
- PE15
- PG14
- PE13
- PD10
- PC7
- PD3
- PA3
- PA8
- PB8
- PD6
- PE12
- PA4
- PC6
- PH6
- (near R136) PG7
- PG2
- PG15
- PB9
- PF15
- PF14
- (near C116) FLE-125-01-G-DV (Samtec)
- Title:
- Project:
- Size:
- Revision:
- Variant:
- A4
- -
- Date:
- Reference:
- Sheet:
- of

### Library data of the parts
C116-C118 = MCD-00006: Capacitor, MLCC, 100nF, 16V, X7R, 10%, 0402, T=0.5mm; Manufacturer_Part_Number: CC0402KRX7R7BB104; Manufacturer: YAGEO; Provided_By: Subcon; Initial_Board_Reference: MB1274; Internal_Part_Number: MCD-00006; ECCN_US: n/a; ECCN_EU: n/a; ComponentLink1Description: Datasheet; Status: Released; Package: C0402; Part_Type: Capacitor; ComponentLink1URL: http://tunmcdsvn.tun.st.com/Component_Datasheet_Library/Trunk/Capacitors/Yageo_Multilayer_Capacitor_X7R_series_100pF_to_22uF
C119 = MCD-00014: Capacitor, MLCC, 10uF, 25V, X5R, 10%, 0805, T=0,85mm; Manufacturer_Part_Number: CC0805KRX5R8BB106; Manufacturer: YAGEO; Provided_By: Subcon; Initial_Board_Reference: MB1274; Internal_Part_Number: MCD-00014; Status: Released; Part_Type: Capacitor; Package: C0805; ComponentLink1Description: Datasheet; ComponentLink1URL: http://tunmcdsvn.tun.st.com/Component_Datasheet_Library/Trunk/Capacitors/Yageo_Multilayer_capacitor_X5R_series_100pF_to_100uF; ECCN_US: n/a; ECCN_EU: n/a
CN19 = MCD-01222: Header 25x2 for MB1046 - LCD 4.3 inches daughter board; Part_Type: Connector; Manufacturer_Part_Number: FLE-125-01-G-DV; Manufacturer: SAMTEC; Provided_By: SUBCO; Initial_Board_Reference: MB1332; Internal_Part_Number: MCD-01222; Value: Header 25x2; Status: Footprint available; ComponentLink1Description: Datasheet; ComponentLink1URL: http://tunmcdsvn.tun.st.com/Component_Datasheet_Library/Trunk/Connectors/Samtec_FLE_smt_series/
R136 = MCD-00052: Resistor,0R,0402,5%,1/16W; Manufacturer_Part_Number: RC0402JR-070RL; Manufacturer: YAGEO; ECCN_US: EAR99; ECCN_EU: NEC; Provided_By: SUBCO; Internal_Part_Number: MCD-00052; Status: Released; Part_Type: Resistor; Package: R0402; ComponentLink1Description: Datasheet; ComponentLink1URL: http://tunmcdsvn.tun.st.com/Component_Datasheet_Library/Trunk/Resistors/Yageo_Resistor_RC0402-series
R137 R138 = MCD-00056: Resistor,0R,0603,5%,1/10W; Manufacturer_Part_Number: RC0603JR-070RL; Manufacturer: YAGEO; Provided_By: subcon; Initial_Board_Reference: MB1274; Internal_Part_Number: MCD-00056; Status: Released; Part_Type: Resistor; Package: R0603; ComponentLink1Description: Datasheet; ComponentLink1URL: http://tunmcdsvn.tun.st.com/Component_Datasheet_Library/Trunk/Resistors/Yageo_Resistor_RC0603-series; ECCN_US: n/a; ECCN_EU: n/a
SB43 SB44 = MCD-00071: as SB26 on sheet OCSPI; Internal_Part_Number: MCD-00071; Status: Released; Package: SB0603; ComponentLink1Description: Datasheet; ComponentLink1URL: http://tunmcdsvn.tun.st.com/Component_Datasheet_Library/Trunk/Resistors/Yageo_Resistor_RC0603-series

## Sheet HyperRAM.SchDoc: HyperRAM
size A4; CompanyName: STMicroelectronics; Organization: Microcontrollers Division; DocumentNumber: 14; SheetNumber: 10; SheetTotal: 19
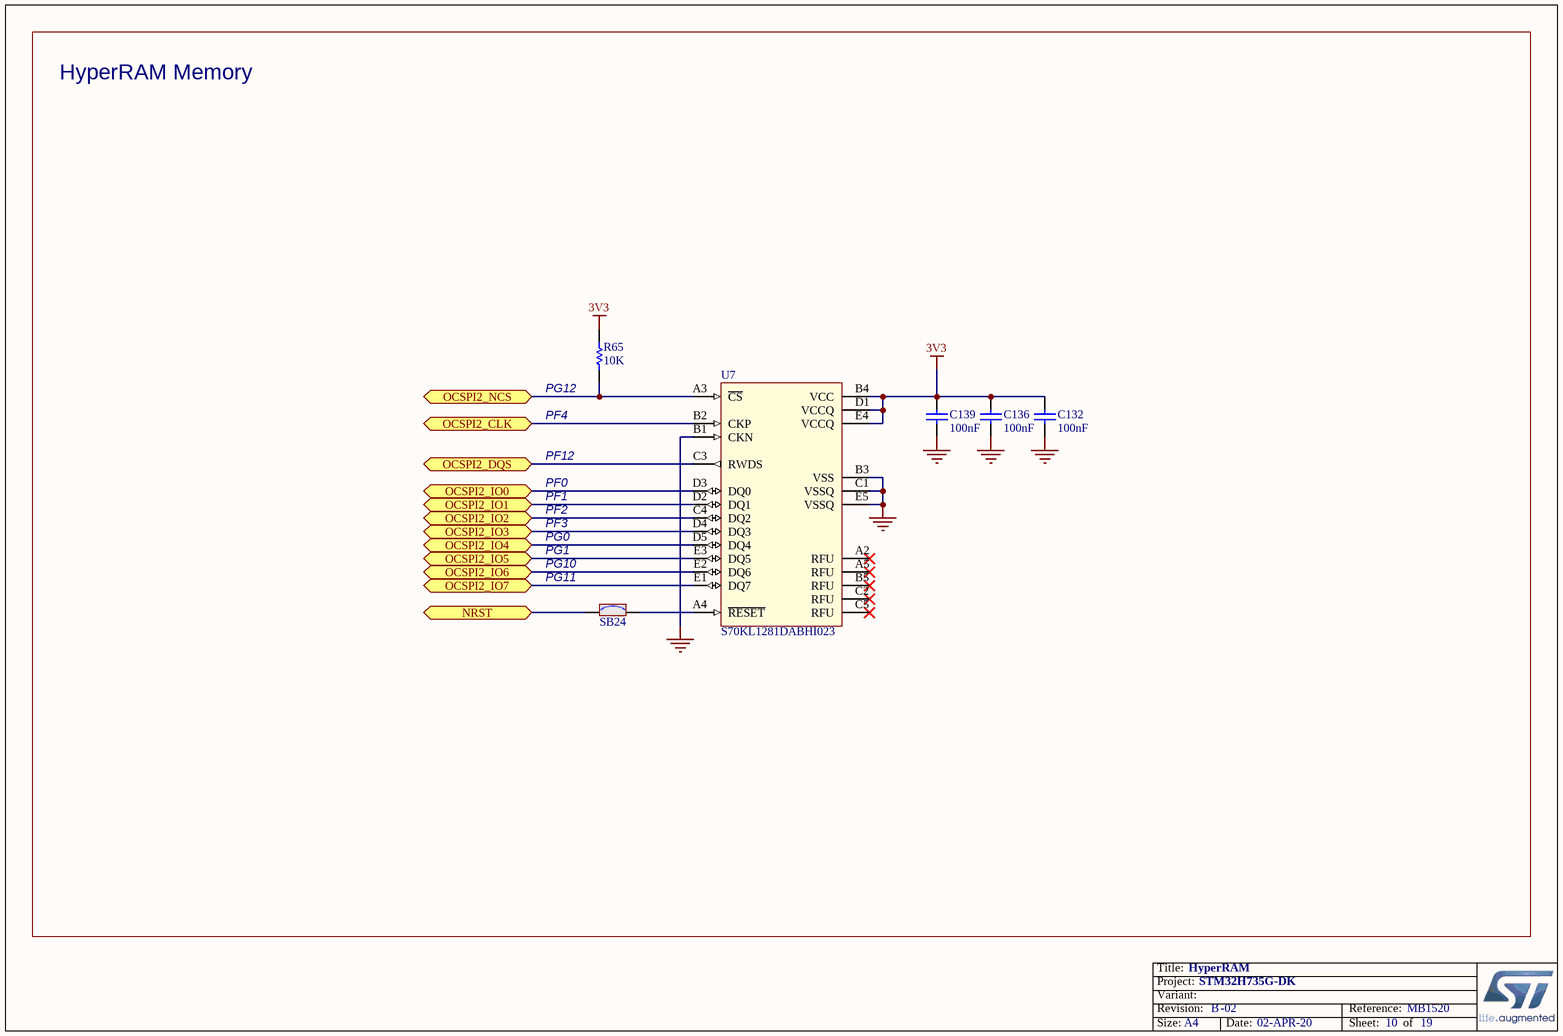
[diagram p16: HyperRAM.SchDoc]

### Parts
C132  value 100nF  [C0402]  (hidden comment: Capacitor)
C136  value 100nF  [C0402]  (hidden comment: Capacitor)
C139  value 100nF  [C0402]  (hidden comment: Capacitor)
R65  value 10K  [R0402]  (hidden comment: Resistor)
SB24  SB_ON  [SOLDER-BRIDGE_R0603-0R]  (value not drawn)
U7  S70KL1281DABHI023  [ICC_FBGA24_5X5-BALL-ARRAY_6X8_P1]

### Ports
NRST (bidir), OCSPI2_CLK (bidir), OCSPI2_DQS (bidir), OCSPI2_IO0 (bidir), OCSPI2_IO1 (bidir), OCSPI2_IO2 (bidir), OCSPI2_IO3 (bidir), OCSPI2_IO4 (bidir), OCSPI2_IO5 (bidir), OCSPI2_IO6 (bidir), OCSPI2_IO7 (bidir), OCSPI2_NCS (bidir)

### Nets
3V3: C132.2 C136.2 C139.2 R65.2 U7.B4(VCC) U7.D1(VCCQ) U7.E4(VCCQ)
GND: C132.1 C136.1 C139.1 U7.B1(CKN) U7.B3(VSS) U7.C1(VSSQ) U7.E5(VSSQ)  [project net POE7]
OCSPI2_CLK: U7.B2(CKP) ; port OCSPI2_CLK
OCSPI2_DQS: U7.C3(RWDS) ; port OCSPI2_DQS
OCSPI2_IO0: U7.D3(DQ0) ; port OCSPI2_IO0
OCSPI2_IO1: U7.D2(DQ1) ; port OCSPI2_IO1
OCSPI2_IO2: U7.C4(DQ2) ; port OCSPI2_IO2
OCSPI2_IO3: U7.D4(DQ3) ; port OCSPI2_IO3
OCSPI2_IO4: U7.D5(DQ4) ; port OCSPI2_IO4
OCSPI2_IO5: U7.E3(DQ5) ; port OCSPI2_IO5
OCSPI2_IO6: U7.E2(DQ6) ; port OCSPI2_IO6
OCSPI2_IO7: U7.E1(DQ7) ; port OCSPI2_IO7
OCSPI2_NCS: R65.1 U7.A3(~{CS}) ; port OCSPI2_NCS
RESET: SB24.1 ; port NRST
NetSB24_2: SB24.2 U7.A4(~{RESET})

Not connected (* = marked no-connect by the designer): U7 A2(RFU)* A5(RFU)* B5(RFU)* C2(RFU)* C5(RFU)*

### Notes on the sheet
- HyperRAM Memory
- (near R65) PG12
- PF4
- PF12
- PF0
- PF1
- PF2
- PF3
- PG0
- PG1
- (near SB24) PG10
- (near SB24) PG11
- Title:
- Project:
- Size:
- Revision:
- Variant:
- A4
- -
- Date:
- Reference:
- Sheet:
- of

### Library data of the parts
C132 C136 C139 = MCD-00102: as C140 on sheet OCSPI; Internal_Part_Number: MCD-00102; Status: Released; Part_Type: Capacitor; Package: C0402; ComponentLink1Description: Datasheet; ComponentLink1URL: http://tunmcdsvn.tun.st.com/Component_Datasheet_Library/Trunk/Capacitors/Yageo_Multilayer_Capacitor_X7R_series_100pF_to_22uF
R65 = MCD-00053: as R81 on sheet OCSPI; Internal_Part_Number: MCD-00053; Status: Released; Part_Type: Resistor; Package: R0402; ComponentLink1Description: Datasheet; ComponentLink1URL: http://tunmcdsvn.tun.st.com/Component_Datasheet_Library/Trunk/Resistors/Yageo_Resistor_RC0402-series
SB24 = MCD-00071: as SB26 on sheet OCSPI; Internal_Part_Number: MCD-00071; Status: Released; Package: SB0603; ComponentLink1Description: Datasheet; ComponentLink1URL: http://tunmcdsvn.tun.st.com/Component_Datasheet_Library/Trunk/Resistors/Yageo_Resistor_RC0603-series; ECCN_US: n/a; ECCN_EU: n/a
U7 = MCD-01824: Memory, HyperRAM,128Mb,100MHz,3V,BGA24; Part_Type: IC; Manufacturer: CYPRESS; Provided_By: SUBCO; Internal_Part_Number: MCD-01824; Status: Checked; Manufacturer_Part_Number: S70KL1281DABHI023; Package: FBGA24; ComponentLink1Description: Datasheet; ComponentLink1URL: http://tunmcdsvn.tun.st.com/Component_Datasheet_Library/Trunk/IC/Cypress_HyperRAM_S70KL1281DABHI023/Cypress_HyperRAM_S70KL1281DABHI023.pdf; ECCN_US: n/a; ECCN_EU: n/a; Value: S70KL1281DABHI023

## Sheet SD CARD.SchDoc: uSD CARD
size A4; CompanyName: STMicroelectronics; Organization: Microcontrollers Division; DocumentNumber: 1; SheetNumber: 11; SheetTotal: 19
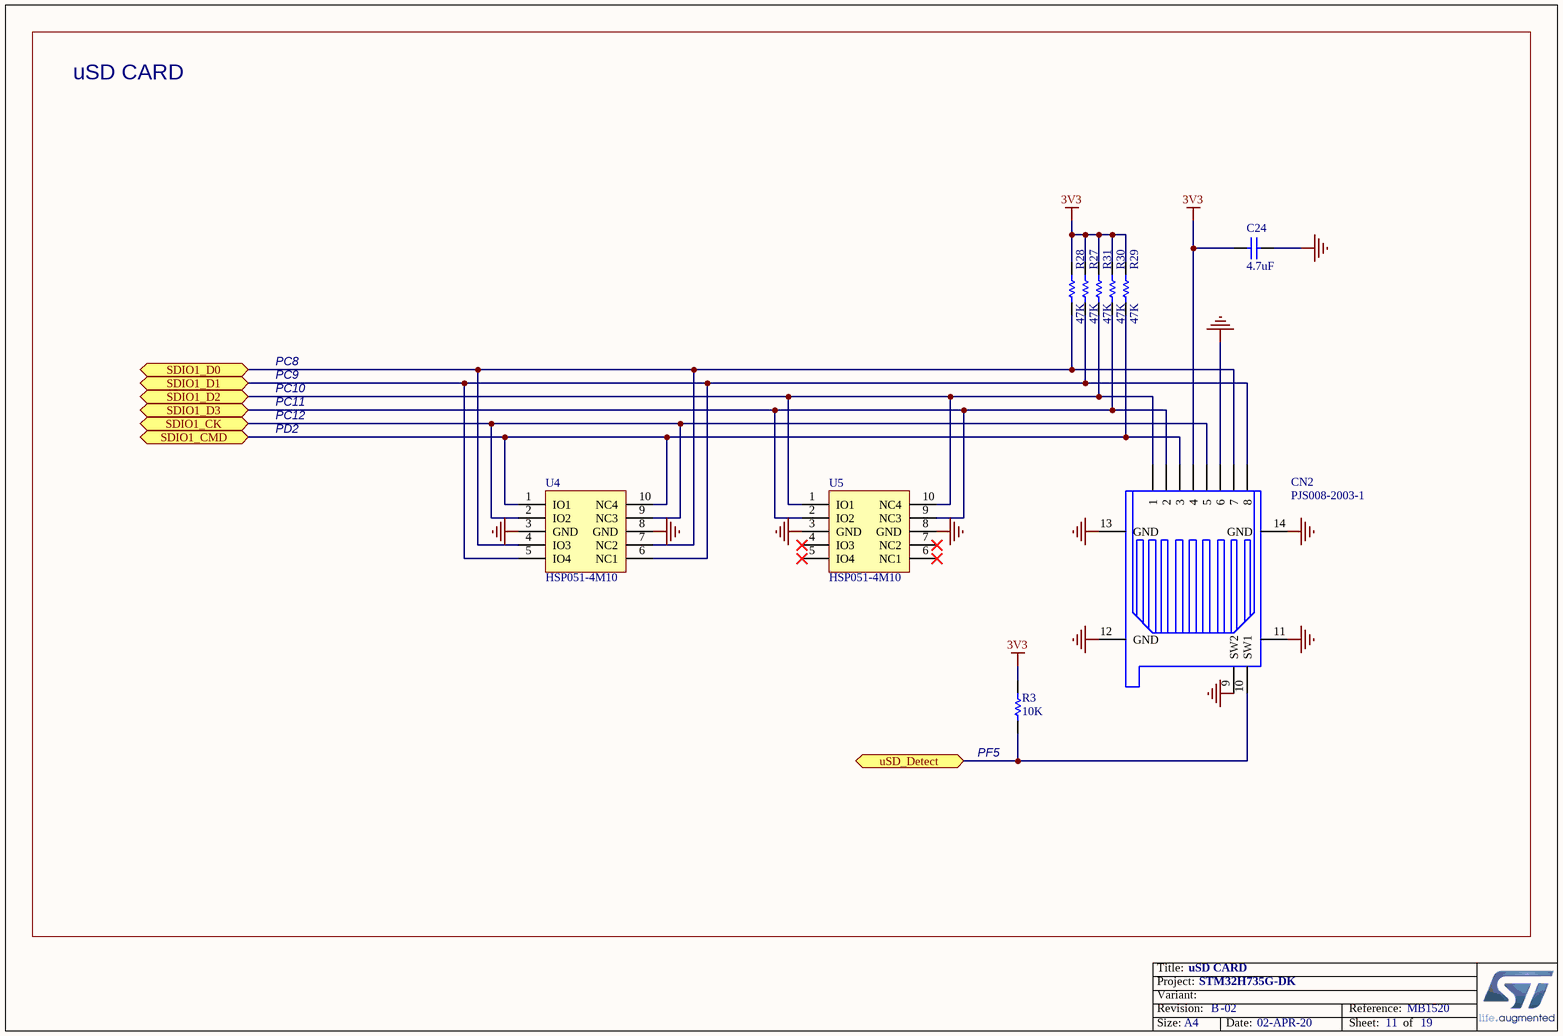
[diagram p17: SD CARD.SchDoc]

### Parts
C24  value 4.7uF  [C0603]  (hidden comment: Capacitor)
CN2  value PJS008-2003-1  [CON_MICROSD_YAMAICHI_PJS008-2003-1]  (hidden comment: microSD-PJS008-2003)
R3  value 10K  [R0603]  (hidden comment: Resistor)
R27  value 47K  [R0402]  (hidden comment: Resistor)
R28  value 47K  [R0402]  (hidden comment: Resistor)
R29  value 47K  [R0402]  (hidden comment: Resistor)
R30  value 47K  [R0402]  (hidden comment: Resistor)
R31  value 47K  [R0402]  (hidden comment: Resistor)
U4  HSP051-4M10  [ESD_UQFN-10L_2P5X1_P050]
U5  HSP051-4M10  [ESD_UQFN-10L_2P5X1_P050]

### Ports
SDIO1_CK, SDIO1_CMD, SDIO1_D0, SDIO1_D1, SDIO1_D2, SDIO1_D3, uSD_Detect

### Nets
3V3: C24.1 CN2.4 R3.2 R27.2 R28.2 R29.2 R30.2 R31.2
GND: C24.2 CN2.6 CN2.9(SW2) CN2.11(GND) CN2.12(GND) CN2.13(GND) CN2.14(GND) U4.3(GND) U4.8(GND) U5.3(GND) U5.8(GND)  [project net POE7]
SDIO1_CK: CN2.5 U4.2(IO2) U4.9(NC3) ; port SDIO1_CK
SDIO1_CMD: CN2.3 R29.1 U4.1(IO1) U4.10(NC4) ; port SDIO1_CMD
SDIO1_D0: CN2.7 R28.1 U4.4(IO3) U4.7(NC2) ; port SDIO1_D0
SDIO1_D1: CN2.8 R27.1 U4.5(IO4) U4.6(NC1) ; port SDIO1_D1
SDIO1_D2: CN2.1 R31.1 U5.1(IO1) U5.10(NC4) ; port SDIO1_D2
SDIO1_D3: CN2.2 R30.1 U5.2(IO2) U5.9(NC3) ; port SDIO1_D3
uSD_Detect: CN2.10(SW1) R3.1 ; port uSD_Detect

Not connected (* = marked no-connect by the designer): U5 4(IO3)* 5(IO4)* 6(NC1)* 7(NC2)*

### Notes on the sheet
- uSD CARD
- PC8
- PC9
- PC10
- PC11
- PC12
- PD2
- (near R3) PF5
- Title:
- Project:
- Size:
- Revision:
- Variant:
- A4
- -
- Date:
- Reference:
- Sheet:
- of

### Library data of the parts
C24 = MCD-01121: Capacitor, MLCC, 4.7µF, 10V, X5R, 20%, 0603, T=0,8mm; Manufacturer_Part_Number: GRM188R61A475ME15; Manufacturer: MURATA; ECCN_US: EAR99; ECCN_EU: NEC; Provided_By: SUBCO; Internal_Part_Number: MCD-01121; Status: Released; Part_Type: Capacitor; Package: C0603; ComponentLink1Description: Datasheet; ComponentLink1URL: http://tunmcdsvn.tun.st.com/Component_Datasheet_Library/Trunk/Capacitors/Murata_Capacitor_GR_series
CN2 = MCD-00023: MicroSD Card Conn, Reversed-Type, Mnt Push-Push, Positionning holes; Part_Type: Connector; Manufacturer: YAMAICHI; Provided_By: SUBCO; Internal_Part_Number: MCD-00023; Status: Released; Manufacturer_Part_Number: PJS008-2003-1; ComponentLink1Description: Datasheet; ComponentLink1URL: http://tunmcdsvn.tun.st.com/Component_Datasheet_Library/Trunk/Connectors/Yamaichi_Connector_microSD-Card-PJS008-2003; ECCN_US: n/a; ECCN_EU: n/a
R3 = MCD-00220: Resistor,10K,0603,1%,1/10W; Manufacturer_Part_Number: RC0603FR-0710KL; Manufacturer: YAGEO; ECCN_US: EAR99; ECCN_EU: NEC; Provided_By: SUBCO; Internal_Part_Number: MCD-00220; Status: Released; Part_Type: Resistor; Package: R0603; ComponentLink1Description: Datasheet; ComponentLink1URL: http://tunmcdsvn.tun.st.com/Component_Datasheet_Library/Trunk/Resistors/Yageo_Resistor_RC0603-series
R27-R31 = MCD-00063: as R125 on sheet STlink_V3E_PWR; Internal_Part_Number: MCD-00063; Status: Released; Part_Type: Resistor; Package: R0402; ComponentLink1Description: Datasheet; ComponentLink1URL: http://tunmcdsvn.tun.st.com/Component_Datasheet_Library/Trunk/Resistors/Yageo_Resistor_RC0402-series
U4 U5 = MCD-00667: 4-line ESD protection for high speed lines; Part_Type: Diode; Manufacturer: STMICROELECTRONICS; BMS_Part_Number: 9179041; ECCN_US: EAR99; ECCN_EU: NEC; Provided_By: SUBCO with ST control; Internal_Part_Number: MCD-00667; Value: HSP051-4M10; Status: Checked; Manufacturer_Part_Number: HSP051-4M10; Package: uQFN-10L; ComponentLink1Description: Datasheet; ComponentLink1URL: http://tunmcdsvn.tun.st.com/Component_Datasheet_Library/Trunk/Diodes/STM_ESD_HSP051-4M10